# Altium schematic sheet EQ_C.SchDoc
size A4
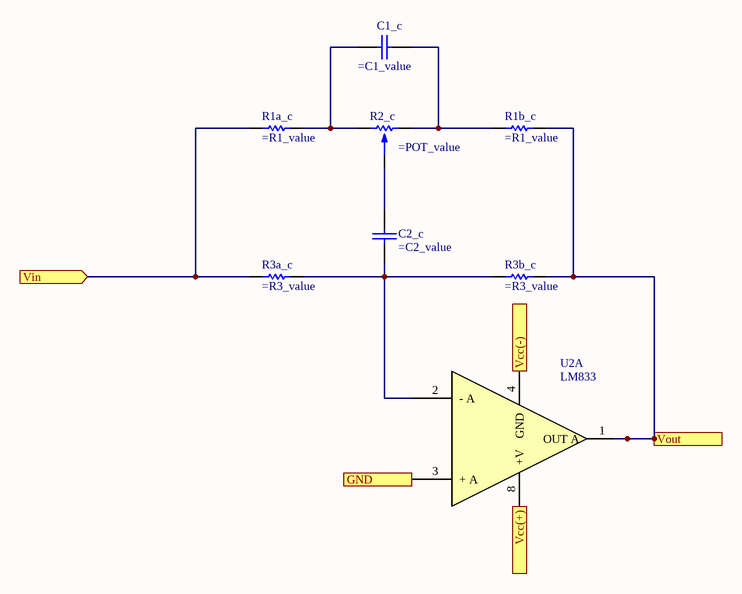
[diagram p0: EQ_C.SchDoc]

## Parts
C1_c  (no value)  [CAP200]
C2_c  (no value)  [CAP200]
R1a_c  (no value)  [0805]
R1b_c  (no value)  [0805]
R2_c  (no value)  [POTENCIOMETRO]
R3a_c  (no value)  [0805]
R3b_c  (no value)  [0805]
U2  LM833  [DIP8]  (part A of 2)

## Ports
GND, Vcc(+) (in), Vcc(-) (in), Vin (in), Vout (out)

## Nets
GND: U2.3(+_A) ; port GND
Vcc(+): U2.8(+V) ; port Vcc(+)
Vcc(-): U2.4(GND) ; port Vcc(-)
Vin: R1a_c.1 R3a_c.1 ; port Vin
Vout: R1b_c.2 R3b_c.2 U2.1(OUT_A) ; port Vout
NetC1_c_1: C1_c.1 R1a_c.2 R2_c.3
NetC1_c_2: C1_c.2 R1b_c.1 R2_c.1
NetC2_c_1: C2_c.1 R2_c.2
NetC2_c_2: C2_c.2 R3a_c.2 R3b_c.1 U2.2(-_A)

## Library data of the parts
C1_c C2_c = CAP
R1a_c R1b_c R3a_c R3b_c = RES
R2_c = POTENCIOMETRO
U2 = LM833: Dual Audio Operational Amplifier